# Altium project flexplatV1.1.PrjPCB
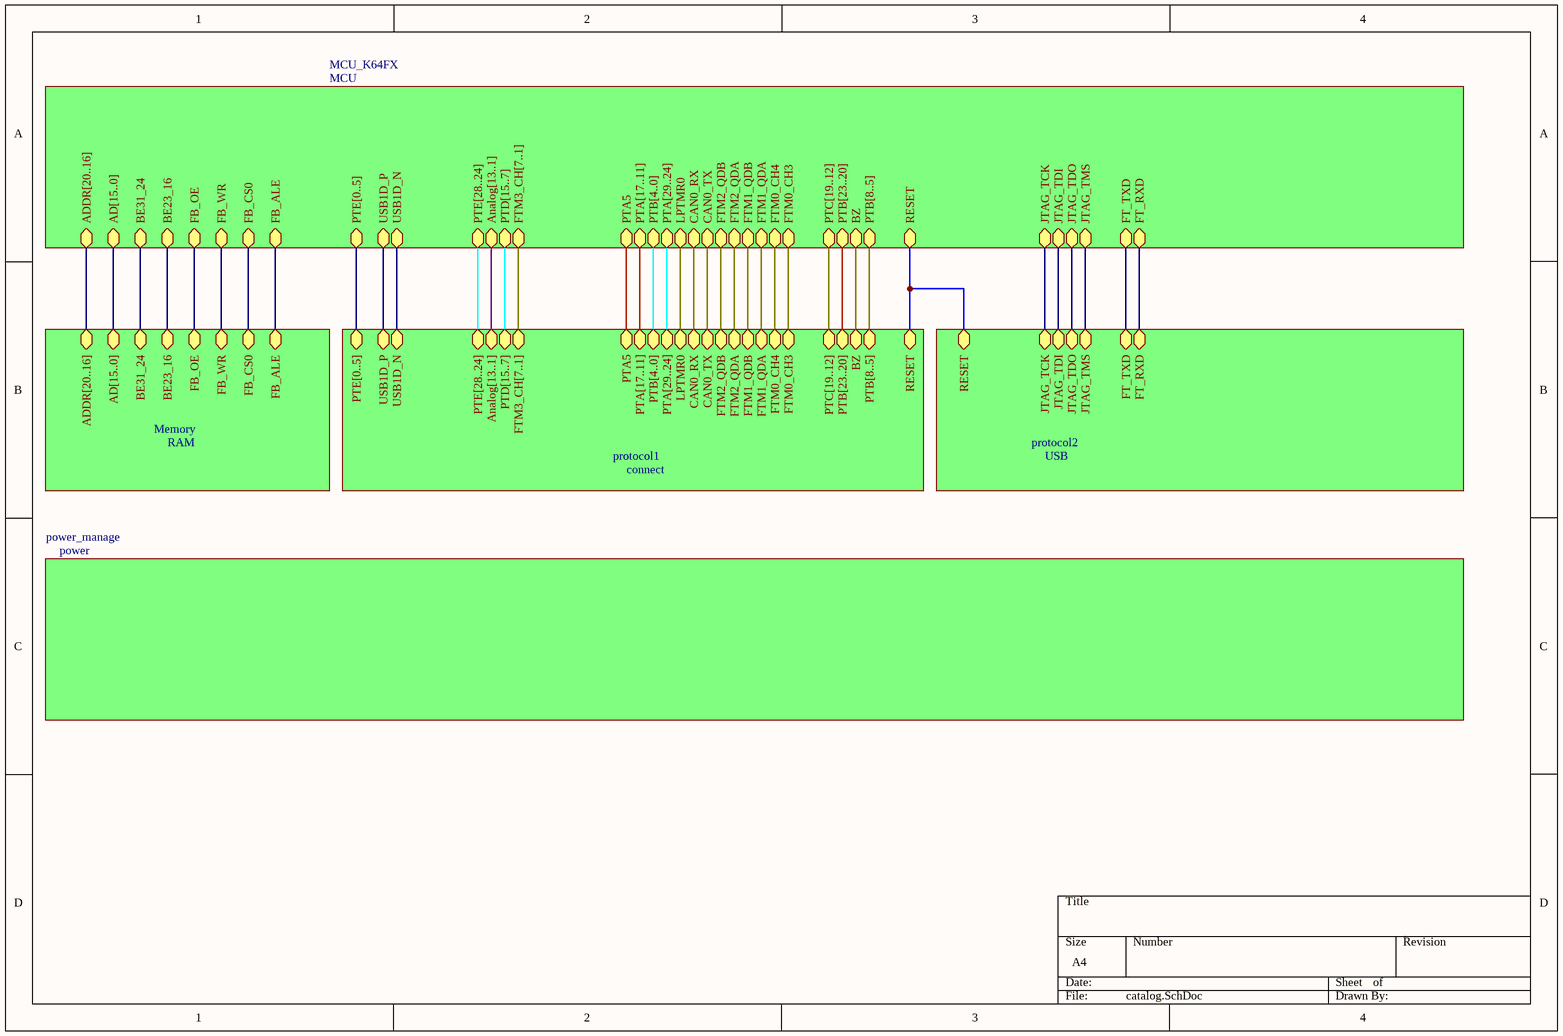
[diagram p0: catalog.SchDoc]
3 sheets, 38 parts. Net scope: hierarchical (ports join the sheet entries above them; power ports are global).
Board files: FPv1.2.PcbDoc, FPv1.3.PcbDoc, FPv1.1.PcbDoc
Sheets:
  catalog.SchDoc
    MCU_K64FX = MCU.SchDoc
    Memory = RAM.SchDoc

## Sheet catalog.SchDoc
size A4; Author: whutddk; DrawnBy: WHUTDDK; Revision: 1.0

### Sub-sheets
MCU_K64FX = MCU: PTE[0..5], ADDR[20..16], AD[15..0], BE31_24, BE23_16, FB_OE, FB_WR, FB_CS0, FB_ALE, JTAG_TCK, JTAG_TDI, JTAG_TDO, JTAG_TMS, USB1D_P, USB1D_N, FT_TXD, FT_RXD, RESET, FTM0_CH3, FTM0_CH4, FTM1_QDA, FTM1_QDB, FTM2_QDB, FTM2_QDA, CAN0_RX, CAN0_TX, LPTMR0, PTA[29..24], PTB[4..0], PTA[17..11], PTA5, FTM3_CH[7..1], PTD[15..7], Analog[13..1], PTE[28..24], PTB[23..20], PTB[8..5], BZ, PTC[19..12]
Memory = RAM: ADDR[20..16], AD[15..0], BE31_24, BE23_16, FB_OE, FB_WR, FB_CS0, FB_ALE
power_manage = power (file not in this document): no entries
protocol1 = connect (file not in this document): PTE[0..5], USB1D_P, USB1D_N, RESET, FTM0_CH3, FTM0_CH4, FTM1_QDA, FTM1_QDB, FTM2_QDB, FTM2_QDA, CAN0_RX, CAN0_TX, LPTMR0, PTA[29..24], PTB[4..0], PTA[17..11], PTA5, FTM3_CH[7..1], PTD[15..7], Analog[13..1], PTE[28..24], PTB[23..20], PTB[8..5], BZ, PTC[19..12]
protocol2 = USB (file not in this document): JTAG_TCK, JTAG_TDI, JTAG_TDO, JTAG_TMS, FT_TXD, FT_RXD, RESET

### Nets
BE23_16: sheet MCU_K64FX/BE23_16, sheet Memory/BE23_16
BE31_24: sheet MCU_K64FX/BE31_24, sheet Memory/BE31_24
CAN0_RX: sheet MCU_K64FX/CAN0_RX, sheet protocol1/CAN0_RX
CAN0_TX: sheet MCU_K64FX/CAN0_TX, sheet protocol1/CAN0_TX
FB_ALE: sheet MCU_K64FX/FB_ALE, sheet Memory/FB_ALE
FB_CS0: sheet MCU_K64FX/FB_CS0, sheet Memory/FB_CS0
FB_OE: sheet MCU_K64FX/FB_OE, sheet Memory/FB_OE
FB_RW: sheet MCU_K64FX/FB_WR, sheet Memory/FB_WR
FTM0_CH3: sheet MCU_K64FX/FTM0_CH3, sheet protocol1/FTM0_CH3
FTM0_CH4: sheet MCU_K64FX/FTM0_CH4, sheet protocol1/FTM0_CH4
FTM1_QDA: sheet MCU_K64FX/FTM1_QDA, sheet protocol1/FTM1_QDA
FTM1_QDB: sheet MCU_K64FX/FTM1_QDB, sheet protocol1/FTM1_QDB
FTM2_QDA: sheet MCU_K64FX/FTM2_QDA, sheet protocol1/FTM2_QDA
FTM2_QDB: sheet MCU_K64FX/FTM2_QDB, sheet protocol1/FTM2_QDB
JTAG_TCK: sheet MCU_K64FX/JTAG_TCK, sheet protocol2/JTAG_TCK
JTAG_TDI: sheet MCU_K64FX/JTAG_TDI, sheet protocol2/JTAG_TDI
JTAG_TDO: sheet MCU_K64FX/JTAG_TDO, sheet protocol2/JTAG_TDO
JTAG_TMS: sheet MCU_K64FX/JTAG_TMS, sheet protocol2/JTAG_TMS
LPTMR0: sheet MCU_K64FX/LPTMR0, sheet protocol1/LPTMR0
n_RST: sheet MCU_K64FX/RESET, sheet protocol1/RESET, sheet protocol2/RESET
PTA5: sheet MCU_K64FX/PTA5, sheet protocol1/PTA5
PTC13: sheet MCU_K64FX/BZ, sheet protocol1/BZ
PTE24: sheet MCU_K64FX/FT_RXD, sheet protocol2/FT_RXD
PTE25: sheet MCU_K64FX/FT_TXD, sheet protocol2/FT_TXD
USB1D_N: sheet MCU_K64FX/USB1D_N, sheet protocol1/USB1D_N
USB1D_P: sheet MCU_K64FX/USB1D_P, sheet protocol1/USB1D_P

### Buses and harness runs
bus sheet MCU_K64FX/AD[15..0] = sheet Memory/AD[15..0]
bus sheet MCU_K64FX/ADDR[20..16] = sheet Memory/ADDR[20..16]
bus sheet MCU_K64FX/Analog[13..1] = sheet protocol1/Analog[13..1]
bus sheet MCU_K64FX/FTM3_CH[7..1] = sheet protocol1/FTM3_CH[7..1]
bus sheet MCU_K64FX/PTA[17..11] = sheet protocol1/PTA[17..11]
bus sheet MCU_K64FX/PTA[29..24] = sheet protocol1/PTA[29..24]
bus sheet MCU_K64FX/PTB[4..0] = sheet protocol1/PTB[4..0]
bus sheet MCU_K64FX/PTB[8..5] = sheet protocol1/PTB[8..5]
bus sheet MCU_K64FX/PTB[23..20] = sheet protocol1/PTB[23..20]
bus sheet MCU_K64FX/PTC[19..12] = sheet protocol1/PTC[19..12]
bus sheet MCU_K64FX/PTD[15..7] = sheet protocol1/PTD[15..7]
bus sheet MCU_K64FX/PTE[0..5] = sheet protocol1/PTE[0..5]
bus sheet MCU_K64FX/PTE[28..24] = sheet protocol1/PTE[28..24]

## Sheet MCU.SchDoc
size A3
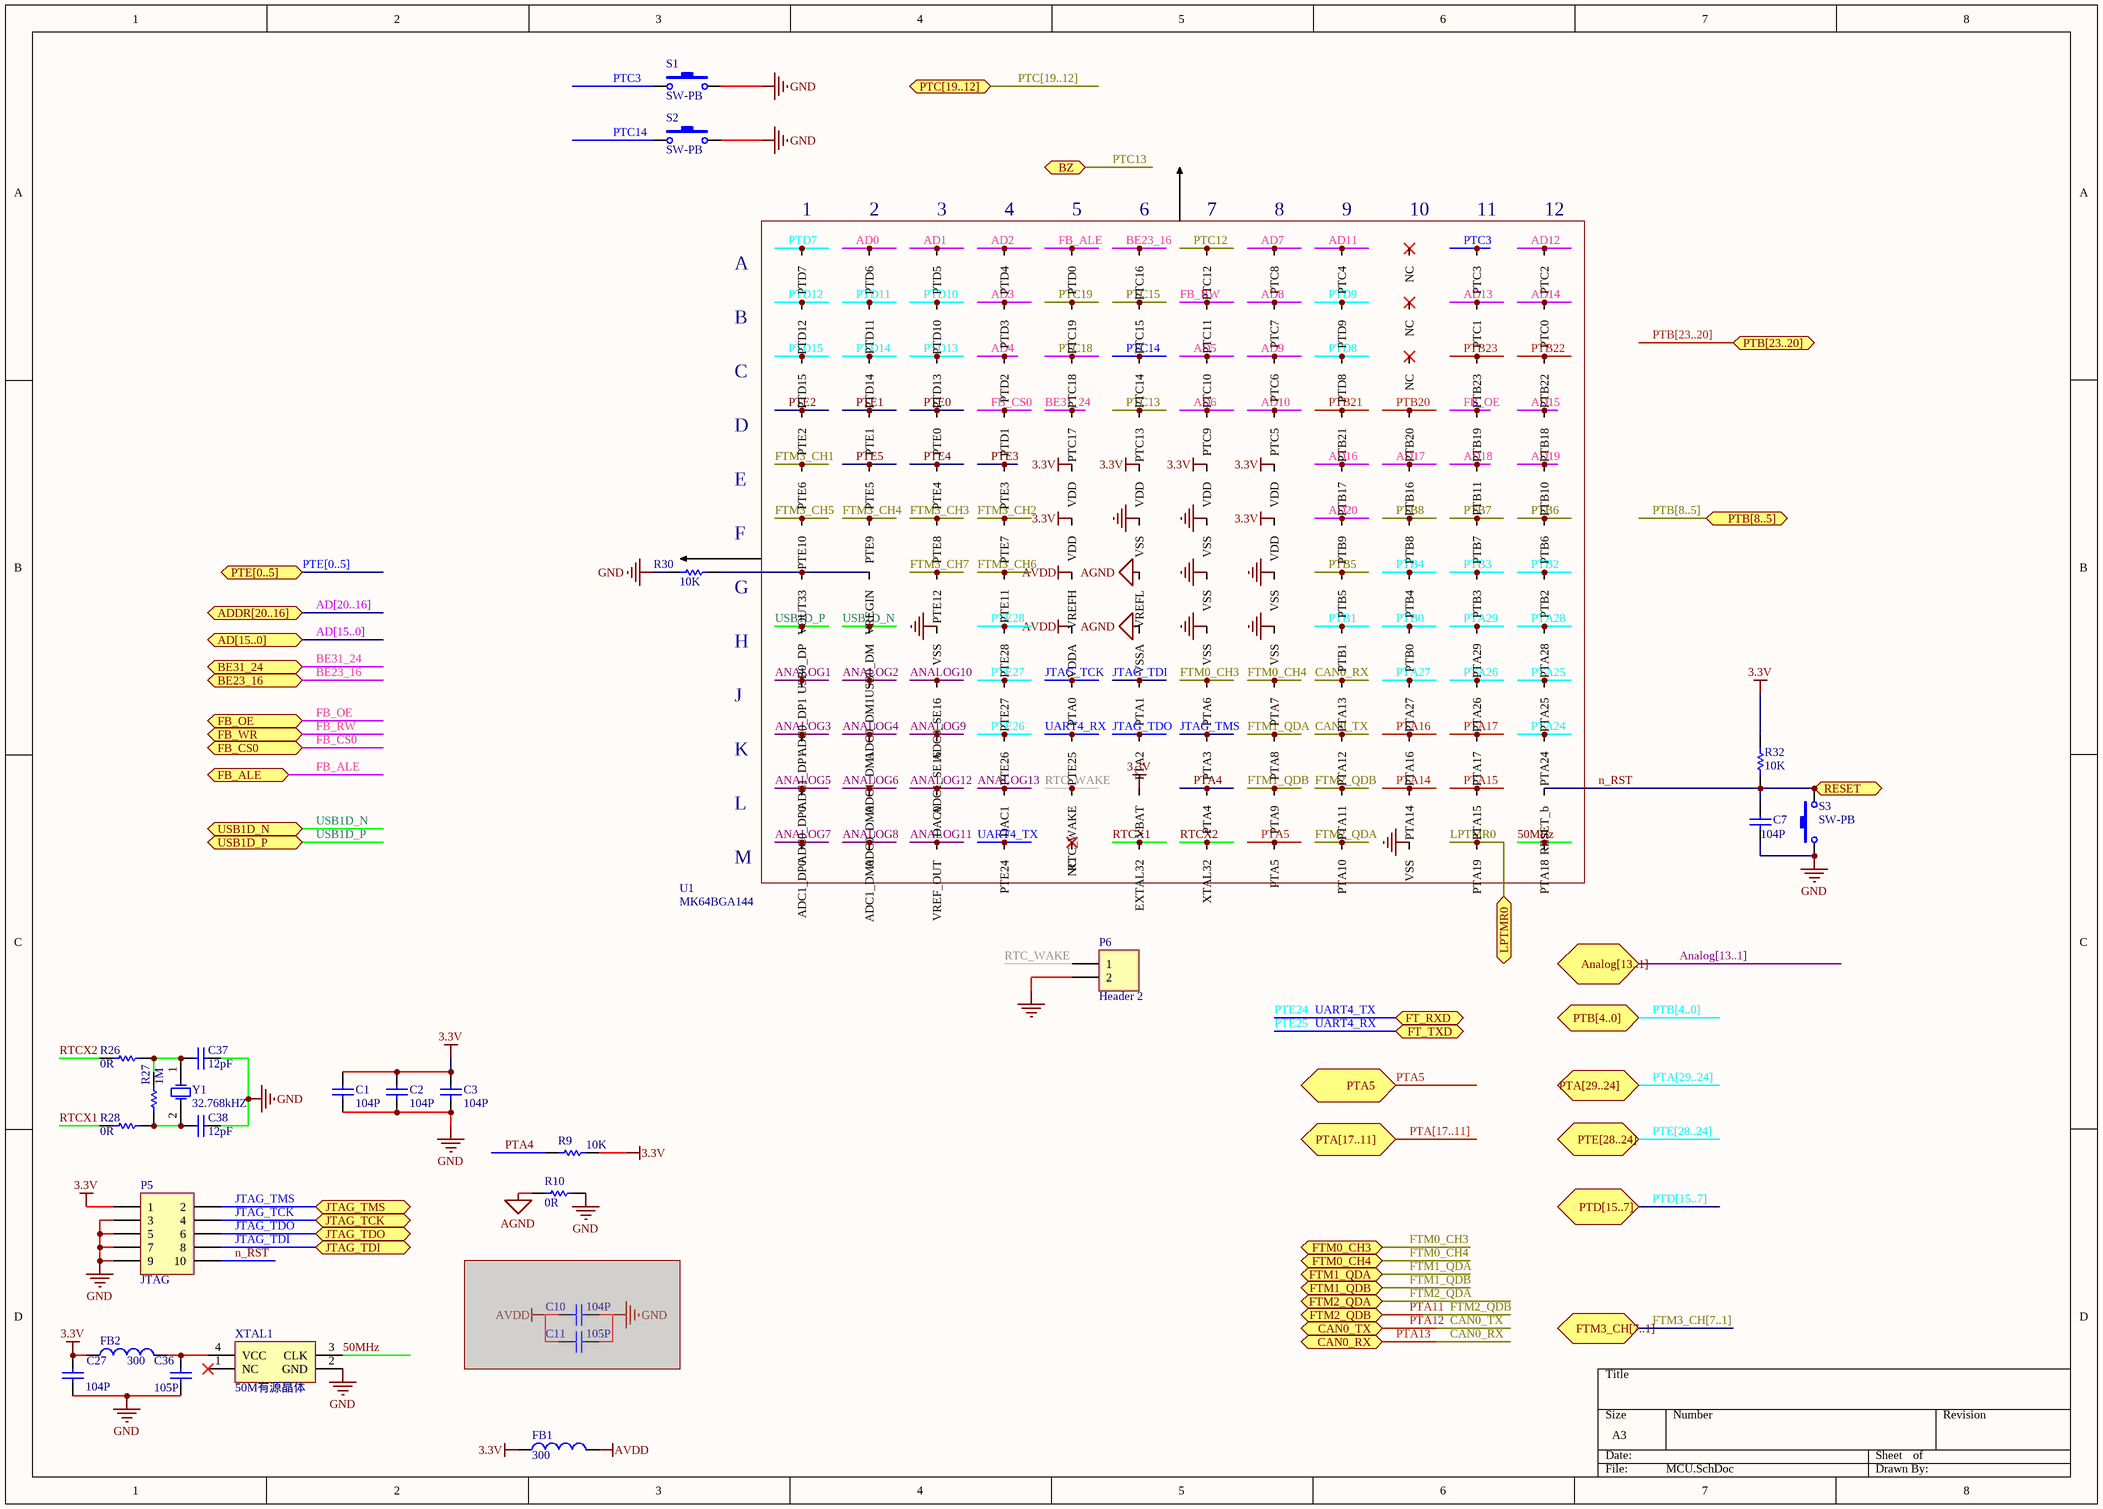
[diagram p1: MCU.SchDoc]

### Parts
C1  value 104P  [1608[0603]]  (hidden comment: Cap)
C2  value 104P  [1608[0603]]  (hidden comment: Cap)
C3  value 104P  [1608[0603]]  (hidden comment: Cap)
C7  value 104P  [1608[0603]]  (hidden comment: Cap)
C10  value 104P  [0402]  (hidden comment: Cap)  (masked out: inside a compile mask, not in the netlist)
C11  value 105P  [0402]  (hidden comment: Cap)  (masked out: inside a compile mask, not in the netlist)
C27  value 104P  [1608[0603]]  (hidden comment: Cap)
C36  value 105P  [1608[0603]]  (hidden comment: Cap)
C37  value 12pF  [1608[0603]]  (hidden comment: Cap)
C38  value 12pF  [1608[0603]]  (hidden comment: Cap)
FB1  value 300  [1608[0603]]  (hidden comment: Inductor)
FB2  value 300  [1608[0603]]  (hidden comment: Inductor)
P5  JTAG  [MHDR2X5]
P6  Header 2  [HDR1X2]
R9  value 10K  [1608[0603]]  (hidden comment: Res)
R10  value 0R  [1608[0603]]  (hidden comment: Res)
R26  value 0R  [1608[0603]]  (hidden comment: Res)
R27  value 1M  [1608[0603]]  (hidden comment: Res)
R28  value 0R  [1608[0603]]  (hidden comment: Res)
R30  value 10K  [1608[0603]]  (hidden comment: Res)
R32  value 10K  [1608[0603]]  (hidden comment: Res)
S1  SW-PB  [key 3*4*2]
S2  SW-PB  [key 3*4*2]
S3  SW-PB  [key 3*4*2]
U1  MK64BGA144  [BGA144C100P12X12_1300X1300X161]
XTAL1  50M有源晶体  [XTAL7_3225]
Y1  32.768kHZ  [3215]

### Ports
AD[15..0], ADDR[20..16], Analog[13..1], BE23_16, BE31_24, BZ, CAN0_RX, CAN0_TX, FB_ALE, FB_CS0, FB_OE, FB_WR, FT_RXD, FT_TXD, FTM0_CH3, FTM0_CH4, FTM1_QDA, FTM1_QDB, FTM2_QDA, FTM2_QDB, FTM3_CH[7..1], JTAG_TCK, JTAG_TDI, JTAG_TDO, JTAG_TMS, LPTMR0, PTA5, PTA[17..11], PTA[29..24], PTB[4..0], PTB[8..5], PTB[23..20], PTC[19..12], PTD[15..7], PTE[0..5], PTE[28..24], RESET, USB1D_N, USB1D_P

### Nets
3.3V: C1.2 C2.2 C3.2 C27.2 FB1.1 FB2.1 P5.1 R9.1 R32.1 U1.E5(VDD) U1.E6(VDD) U1.E7(VDD) U1.E8(VDD) U1.F5(VDD) U1.F8(VDD) U1.L6(VBAT)
AGND: R10.2 U1.G6(VREFL) U1.H6(VSSA)
AVDD: FB1.2 U1.G5(VREFH) U1.H5(VDDA)
GND: C1.1 C2.1 C3.1 C7.1 C27.1 C36.1 C37.1 C38.1 P5.3 P5.5 P5.7 P5.9 P6.2 R10.1 R30.1 S1.2 S2.2 S3.1 U1.F6(VSS) U1.F7(VSS) U1.G7(VSS) U1.G8(VSS) U1.H3(VSS) U1.H7(VSS) U1.H8(VSS) U1.M10(VSS) XTAL1.2(GND)
50MHz: U1.M12(PTA18) XTAL1.3(CLK)
AD0: U1.A2(PTD6)
AD1: U1.A3(PTD5)
AD2: U1.A4(PTD4)
AD3: U1.B4(PTD3)
AD4: U1.C4(PTD2)
AD5: U1.C7(PTC10)
AD6: U1.D7(PTC9)
AD7: U1.A8(PTC8)
AD8: U1.B8(PTC7)
AD9: U1.C8(PTC6)
AD10: U1.D8(PTC5)
AD11: U1.A9(PTC4)
AD12: U1.A12(PTC2)
AD13: U1.B11(PTC1)
AD14: U1.B12(PTC0)
AD15: U1.D12(PTB18)
AD16: U1.E9(PTB17)
AD17: U1.E10(PTB16)
AD18: U1.E11(PTB11)
AD19: U1.E12(PTB10)
AD20: U1.F9(PTB9)
ANALOG1: U1.J1(ADC0_DP1)
ANALOG2: U1.J2(ADC0_DM1)
ANALOG3: U1.K1(ADC1_DP1)
ANALOG4: U1.K2(ADC1_DM1)
ANALOG5: U1.L1(ADC0_DP0)
ANALOG6: U1.L2(ADC0_DM0)
ANALOG7: U1.M1(ADC1_DP0)
ANALOG8: U1.M2(ADC1_DM0)
ANALOG9: U1.K3(ADC1_SE16)
ANALOG10: U1.J3(ADC0_SE16)
ANALOG11: U1.M3(VREF_OUT)
ANALOG12: U1.L3(DAC0)
ANALOG13: U1.L4(DAC1)
BE23_16: U1.A6(PTC16) ; port BE23_16
BE31_24: U1.D5(PTC17) ; port BE31_24
CAN0_RX: U1.J9(PTA13) ; port CAN0_RX  [also labelled PTA13]
CAN0_TX: U1.K9(PTA12) ; port CAN0_TX  [also labelled PTA12]
FB_ALE: U1.A5(PTD0) ; port FB_ALE
FB_CS0: U1.D4(PTD1) ; port FB_CS0
FB_OE: U1.D11(PTB19) ; port FB_OE
FB_RW: U1.B7(PTC11) ; port FB_WR
FTM0_CH3: U1.J7(PTA6) ; port FTM0_CH3
FTM0_CH4: U1.J8(PTA7) ; port FTM0_CH4
FTM1_QDA: U1.K8(PTA8) ; port FTM1_QDA
FTM1_QDB: U1.L8(PTA9) ; port FTM1_QDB
FTM2_QDA: U1.M9(PTA10) ; port FTM2_QDA
FTM2_QDB: U1.L9(PTA11) ; port FTM2_QDB  [also labelled PTA11]
FTM3_CH1: U1.E1(PTE6)
FTM3_CH2: U1.F4(PTE7)
FTM3_CH3: U1.F3(PTE8)
FTM3_CH4: U1.F2(PTE9)
FTM3_CH5: U1.F1(PTE10)
FTM3_CH6: U1.G4(PTE11)
FTM3_CH7: U1.G3(PTE12)
JTAG_TCK: P5.4 U1.J5(PTA0) ; port JTAG_TCK
JTAG_TDI: P5.8 U1.J6(PTA1) ; port JTAG_TDI
JTAG_TDO: P5.6 U1.K6(PTA2) ; port JTAG_TDO
JTAG_TMS: P5.2 U1.K7(PTA3) ; port JTAG_TMS
LPTMR0: U1.M11(PTA19) ; port LPTMR0
n_RST: C7.2 P5.10 R32.2 S3.2 U1.L12(RESET_b) ; port RESET
PTA4: R9.2 U1.L7(PTA4)
PTA5: U1.M8(PTA5) ; port PTA5
PTA14: U1.L10(PTA14)
PTA15: U1.L11(PTA15)
PTA16: U1.K10(PTA16)
PTA17: U1.K11(PTA17)
PTA24: U1.K12(PTA24)
PTA25: U1.J12(PTA25)
PTA26: U1.J11(PTA26)
PTA27: U1.J10(PTA27)
PTA28: U1.H12(PTA28)
PTA29: U1.H11(PTA29)
PTB0: U1.H10(PTB0)
PTB1: U1.H9(PTB1)
PTB2: U1.G12(PTB2)
PTB3: U1.G11(PTB3)
PTB4: U1.G10(PTB4)
PTB5: U1.G9(PTB5)
PTB6: U1.F12(PTB6)
PTB7: U1.F11(PTB7)
PTB8: U1.F10(PTB8)
PTB20: U1.D10(PTB20)
PTB21: U1.D9(PTB21)
PTB22: U1.C12(PTB22)
PTB23: U1.C11(PTB23)
PTC3: S1.1 U1.A11(PTC3)
PTC12: U1.A7(PTC12)
PTC13: U1.D6(PTC13) ; port BZ
PTC14: S2.1 U1.C6(PTC14)
PTC15: U1.B6(PTC15)
PTC18: U1.C5(PTC18)
PTC19: U1.B5(PTC19)
PTD7: U1.A1(PTD7)
PTD8: U1.C9(PTD8)
PTD9: U1.B9(PTD9)
PTD10: U1.B3(PTD10)
PTD11: U1.B2(PTD11)
PTD12: U1.B1(PTD12)
PTD13: U1.C3(PTD13)
PTD14: U1.C2(PTD14)
PTD15: U1.C1(PTD15)
PTE0: U1.D3(PTE0)
PTE1: U1.D2(PTE1)
PTE2: U1.D1(PTE2)
PTE3: U1.E4(PTE3)
PTE4: U1.E3(PTE4)
PTE5: U1.E2(PTE5)
PTE24: U1.M4(PTE24) ; port FT_RXD  [also labelled UART4_TX]
PTE25: U1.K5(PTE25) ; port FT_TXD  [also labelled UART4_RX]
PTE26: U1.K4(PTE26)
PTE27: U1.J4(PTE27)
PTE28: U1.H4(PTE28)
RTC_WAKE: P6.1 U1.L5(RTC_WAKE)
RTCX1: R28.2 U1.M6(EXTAL32)
RTCX2: R26.2 U1.M7(XTAL32)
USB1D_N: U1.H2(USB0_DM) ; port USB1D_N
USB1D_P: U1.H1(USB0_DP) ; port USB1D_P
NetC36_2: C36.2 FB2.2 XTAL1.4(VCC)
NetC37_2: C37.2 R26.1 R27.1 Y1.1(OSC1)
NetC38_2: C38.2 R27.2 R28.1 Y1.2(OSC2)
NetR30_2: R30.2 U1.G1(VOUT33) U1.G2(VREGIN)

Not connected (* = marked no-connect by the designer): U1 A10(NC)* B10(NC)* C10(NC)* M5(NC)*; XTAL1 1(NC)*

### Buses and harness runs
bus AD[15..0] = port AD[15..0]
bus AD[20..16] = port ADDR[20..16]
bus Analog[13..1] = port Analog[13..1]
bus FTM3_CH[7..1] = port FTM3_CH[7..1]
bus PTA[17..11] = port PTA[17..11]
bus PTA[29..24] = port PTA[29..24]
bus PTB[4..0] = port PTB[4..0]
bus PTB[8..5] = port PTB[8..5]
bus PTB[23..20] = port PTB[23..20]
bus PTC[19..12] = port PTC[19..12]
bus PTD[15..7] = port PTD[15..7]
bus PTE[0..5] = port PTE[0..5]
bus PTE[28..24] = port PTE[28..24]

### Notes on the sheet
- (in symbol MK64BGA144) 1; 2; 3; 4; 5; 6; 7; 8; 9; 10; 11; 12; A; B; C; D; E; F; G; H; J; K; L; M

### Library data of the parts
C1-C3 C7 C10 C11 C27 C36-C38 = Cap: 贴片电容; Published: 8-Jun-2000; LatestRevisionDate: 17-Jul-2002; LatestRevisionNote: Re-released for DXP Platform.; PackageReference: RAD-0.3; Publisher: Altium Limited
FB1 FB2 = Inductor: Code_IEC: 1005; Published: 8-Jun-2000; LatestRevisionDate: 29-May-2009; LatestRevisionNote: IPC-7351 Footprint Added.; PackageReference: 0402-A; Publisher: Altium Limited; PackageDescription: Chip Inductor; Code_JEITA: 0402
P5 = Header 5X2: Header, 5-Pin, Dual row; LatestRevisionDate: 17-Jul-2002; LatestRevisionNote: Re-released for DXP Platform.; Publisher: Altium Limited
P6 = Header 2: Header, 2-Pin; LatestRevisionDate: 17-Jul-2002; LatestRevisionNote: Re-released for DXP Platform.; Publisher: Altium Limited
R9 R10 R26-R28 R30 R32 = Res: 贴片电阻; Published: 8-Jun-2000; LatestRevisionDate: 17-Jul-2002; LatestRevisionNote: Re-released for DXP Platform.; PackageReference: AXIAL-0.3; Publisher: Altium Limited
S1-S3 = SW-PB: Switch
XTAL1 = 有源晶体
Y1 = XTAL: 晶体振荡器; Published: 8-Jun-2000; LatestRevisionDate: 17-Jul-2002; LatestRevisionNote: Re-released for DXP Platform.; PackageReference: R38; Publisher: Altium Limited

## Sheet RAM.SchDoc
size A4
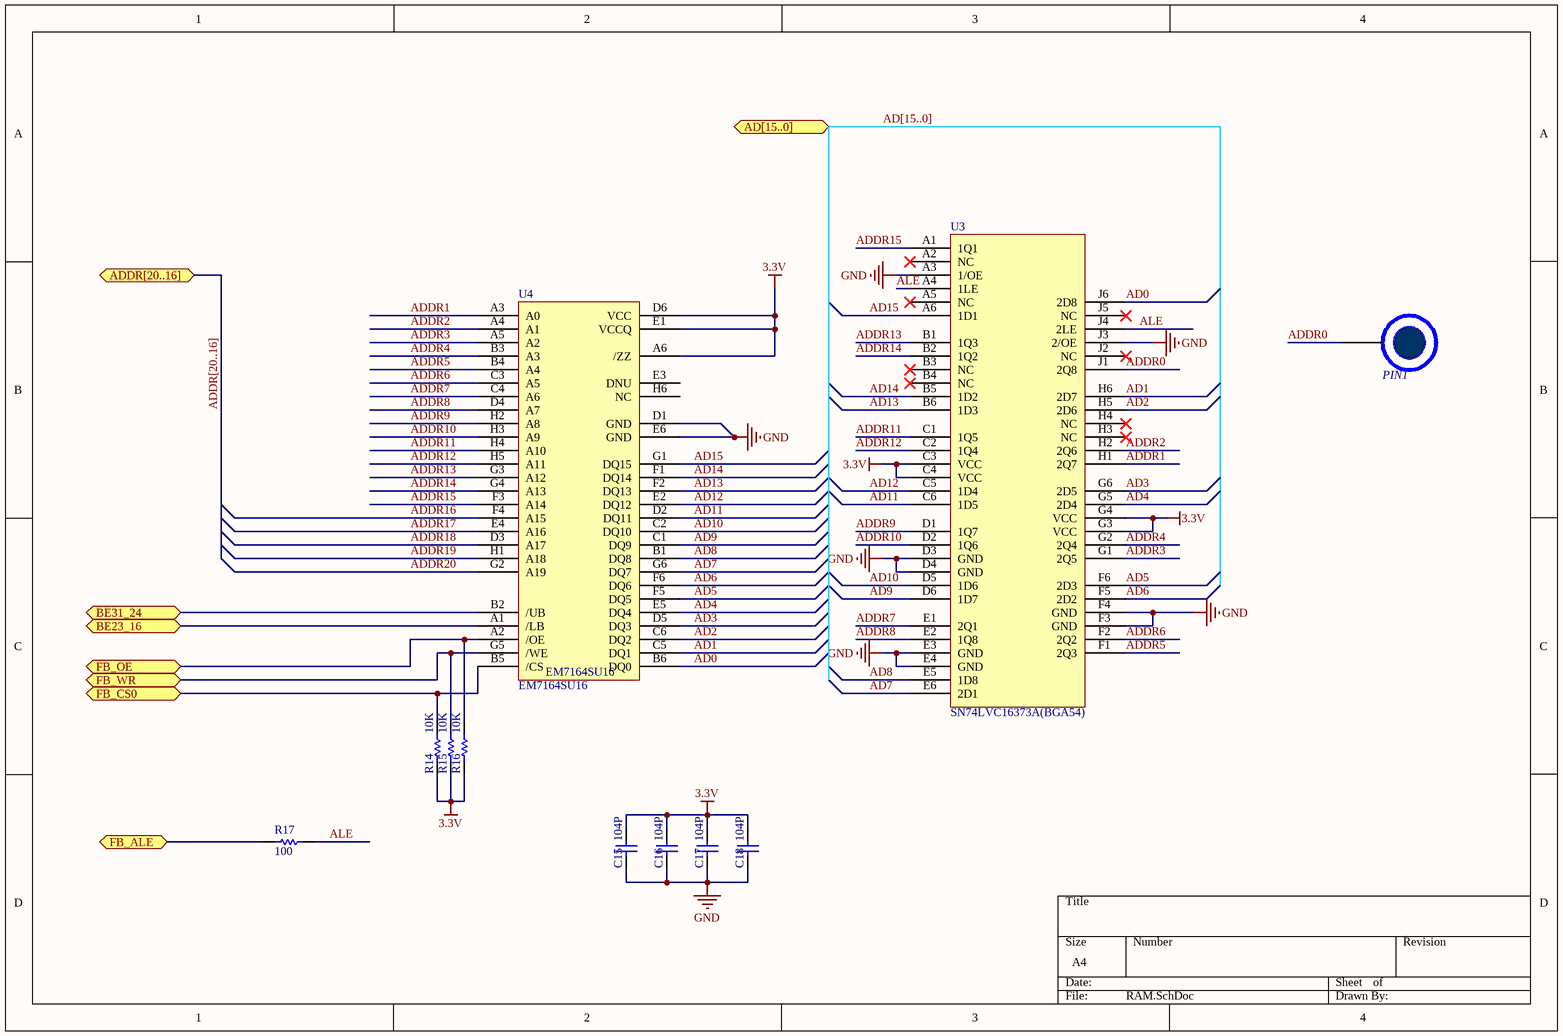
[diagram p2: RAM.SchDoc]

### Parts
C15  value 104P  [1608[0603]]  (hidden comment: Cap)
C16  value 104P  [1608[0603]]  (hidden comment: Cap)
C17  value 104P  [1608[0603]]  (hidden comment: Cap)
C18  value 104P  [1608[0603]]  (hidden comment: Cap)
PIN1  PIN  [PIN]  (value not drawn)
R14  value 10K  [1608[0603]]  (hidden comment: Res)
R15  value 10K  [1608[0603]]  (hidden comment: Res)
R16  value 10K  [1608[0603]]  (hidden comment: Res)
R17  value 100  [1608[0603]]  (hidden comment: Res)
U3  SN74LVC16373A(BGA54)  [BGA54C80P6X9_550X800X120]
U4  EM7164SU16  [BGA48C75P6X8_598X698X104]

### Ports
AD[15..0], ADDR[20..16], BE23_16, BE31_24, FB_ALE, FB_CS0, FB_OE, FB_WR

### Nets
3.3V: C15.2 C16.2 C17.2 C18.2 R14.2 R15.2 R16.2 U3.C3(VCC) U3.C4(VCC) U3.G3(VCC) U3.G4(VCC) U4.A6(/ZZ) U4.D6(VCC) U4.E1(VCCQ)
GND: C15.1 C16.1 C17.1 C18.1 U3.A3(1/OE) U3.D3(GND) U3.D4(GND) U3.E3(GND) U3.E4(GND) U3.F3(GND) U3.F4(GND) U3.J3(2/OE) U4.D1(GND) U4.E6(GND)
AD0: U3.J6(2D8) U4.B6(DQ0)
AD1: U3.H6(2D7) U4.C5(DQ1)
AD2: U3.H5(2D6) U4.C6(DQ2)
AD3: U3.G6(2D5) U4.D5(DQ3)
AD4: U3.G5(2D4) U4.E5(DQ4)
AD5: U3.F6(2D3) U4.F5(DQ5)
AD6: U3.F5(2D2) U4.F6(DQ6)
AD7: U3.E6(2D1) U4.G6(DQ7)
AD8: U3.E5(1D8) U4.B1(DQ8)
AD9: U3.D6(1D7) U4.C1(DQ9)
AD10: U3.D5(1D6) U4.C2(DQ10)
AD11: U3.C6(1D5) U4.D2(DQ11)
AD12: U3.C5(1D4) U4.E2(DQ12)
AD13: U3.B6(1D3) U4.F2(DQ13)
AD14: U3.B5(1D2) U4.F1(DQ14)
AD15: U3.A6(1D1) U4.G1(DQ15)
ADDR0: PIN1.1(PIN) U3.J1(2Q8)
ADDR1: U3.H1(2Q7) U4.A3(A0)
ADDR2: U3.H2(2Q6) U4.A4(A1)
ADDR3: U3.G1(2Q5) U4.A5(A2)
ADDR4: U3.G2(2Q4) U4.B3(A3)
ADDR5: U3.F1(2Q3) U4.B4(A4)
ADDR6: U3.F2(2Q2) U4.C3(A5)
ADDR7: U3.E1(2Q1) U4.C4(A6)
ADDR8: U3.E2(1Q8) U4.D4(A7)
ADDR9: U3.D1(1Q7) U4.H2(A8)
ADDR10: U3.D2(1Q6) U4.H3(A9)
ADDR11: U3.C1(1Q5) U4.H4(A10)
ADDR12: U3.C2(1Q4) U4.H5(A11)
ADDR13: U3.B1(1Q3) U4.G3(A12)
ADDR14: U3.B2(1Q2) U4.G4(A13)
ADDR15: U3.A1(1Q1) U4.F3(A14)
ADDR16: U4.F4(A15)  [project net AD16]
ADDR17: U4.E4(A16)  [project net AD17]
ADDR18: U4.D3(A17)  [project net AD18]
ADDR19: U4.H1(A18)  [project net AD19]
ADDR20: U4.G2(A19)  [project net AD20]
ALE: R17.2 U3.A4(1LE) U3.J4(2LE)
BE23_16: U4.A1(/LB) ; port BE23_16
BE31_24: U4.B2(/UB) ; port BE31_24
FB_ALE: R17.1 ; port FB_ALE
FB_CS0: R14.1 U4.B5(/CS) ; port FB_CS0
FB_OE: R16.1 U4.A2(/OE) ; port FB_OE
FB_RW: R15.1 U4.G5(/WE) ; port FB_WR

Not connected (* = marked no-connect by the designer): U3 A2(NC)* A5(NC)* B3(NC)* B4(NC)* H3(NC)* H4(NC)* J2(NC)* J5(NC)*; U4 E3(DNU) H6(NC)

### Buses and harness runs
bus AD[15..0] = port AD[15..0]
bus ADDR[20..16] = port ADDR[20..16]

### Library data of the parts
C15-C18 = Cap: 贴片电容; Published: 8-Jun-2000; LatestRevisionDate: 17-Jul-2002; LatestRevisionNote: Re-released for DXP Platform.; PackageReference: RAD-0.3; Publisher: Altium Limited
R14-R17 = Res: 贴片电阻; Published: 8-Jun-2000; LatestRevisionDate: 17-Jul-2002; LatestRevisionNote: Re-released for DXP Platform.; PackageReference: AXIAL-0.3; Publisher: Altium Limited

## Nets that join several sheets
3.3V: MCU (16 pins), RAM (14 pins)
GND: MCU (27 pins), RAM (14 pins)
AD0: MCU (U1.A2), RAM (U3.J6 U4.B6)
AD1: MCU (U1.A3), RAM (U3.H6 U4.C5)
AD2: MCU (U1.A4), RAM (U3.H5 U4.C6)
AD3: MCU (U1.B4), RAM (U3.G6 U4.D5)
AD4: MCU (U1.C4), RAM (U3.G5 U4.E5)
AD5: MCU (U1.C7), RAM (U3.F6 U4.F5)
AD6: MCU (U1.D7), RAM (U3.F5 U4.F6)
AD7: MCU (U1.A8), RAM (U3.E6 U4.G6)
AD8: MCU (U1.B8), RAM (U3.E5 U4.B1)
AD9: MCU (U1.C8), RAM (U3.D6 U4.C1)
AD10: MCU (U1.D8), RAM (U3.D5 U4.C2)
AD11: MCU (U1.A9), RAM (U3.C6 U4.D2)
AD12: MCU (U1.A12), RAM (U3.C5 U4.E2)
AD13: MCU (U1.B11), RAM (U3.B6 U4.F2)
AD14: MCU (U1.B12), RAM (U3.B5 U4.F1)
AD15: MCU (U1.D12), RAM (U3.A6 U4.G1)
AD16: MCU (U1.E9), RAM (U4.F4)
AD17: MCU (U1.E10), RAM (U4.E4)
AD18: MCU (U1.E11), RAM (U4.D3)
AD19: MCU (U1.E12), RAM (U4.H1)
AD20: MCU (U1.F9), RAM (U4.G2)
BE23_16: MCU (U1.A6), RAM (U4.A1)
BE31_24: MCU (U1.D5), RAM (U4.B2)
FB_ALE: MCU (U1.A5), RAM (R17.1)
FB_CS0: MCU (U1.D4), RAM (R14.1 U4.B5)
FB_OE: MCU (U1.D11), RAM (R16.1 U4.A2)
FB_RW: MCU (U1.B7), RAM (R15.1 U4.G5)